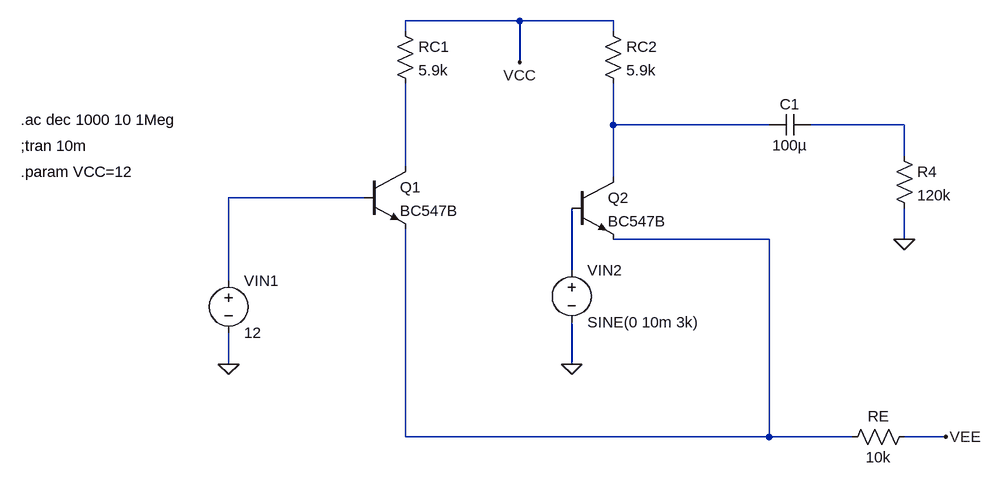
[diagram p0: schematic 1_preamp.asc]
1_preamp.asc, the LTspice schematic file:
Version 4
SHEET 1 1004 680
WIRE 288 -480 112 -480
WIRE 432 -480 288 -480
WIRE 112 -464 112 -480
WIRE 432 -464 432 -480
WIRE 288 -416 288 -480
WIRE 432 -320 432 -384
WIRE 672 -320 432 -320
WIRE 880 -320 736 -320
WIRE 880 -272 880 -320
WIRE 112 -256 112 -384
WIRE 432 -240 432 -320
WIRE 48 -208 -160 -208
WIRE 672 -144 432 -144
WIRE 880 -144 880 -192
WIRE 368 -96 368 -192
WIRE -160 -80 -160 -208
WIRE -160 48 -160 0
WIRE 368 48 368 -16
WIRE 112 160 112 -160
WIRE 672 160 672 -144
WIRE 672 160 112 160
WIRE 800 160 672 160
WIRE 944 160 880 160
FLAG -160 48 0
FLAG 368 48 0
FLAG 880 -144 0
FLAG 288 -416 VCC
FLAG 944 160 VEE
SYMBOL npn 48 -256 R0
SYMATTR InstName Q1
SYMATTR Value BC547B
SYMBOL voltage -160 -96 R0
SYMATTR InstName VIN1
SYMATTR Value 12
SYMBOL res 96 -480 R0
SYMATTR InstName RC1
SYMATTR Value 5.9k
SYMBOL res 416 -480 R0
SYMATTR InstName RC2
SYMATTR Value 5.9k
SYMBOL npn 368 -240 R0
SYMATTR InstName Q2
SYMATTR Value BC547B
SYMBOL voltage 368 -112 R0
WINDOW 123 0 0 Left 0
WINDOW 39 0 0 Left 0
SYMATTR InstName VIN2
SYMATTR Value SINE(0 10m 3k)
SYMBOL res 896 144 R90
WINDOW 0 0 56 VBottom 2
WINDOW 3 32 56 VTop 2
SYMATTR InstName RE
SYMATTR Value 10k
SYMBOL cap 736 -336 R90
WINDOW 0 0 32 VBottom 2
WINDOW 3 32 32 VTop 2
SYMATTR InstName C1
SYMATTR Value 100µ
SYMBOL res 864 -288 R0
SYMATTR InstName R4
SYMATTR Value 120k
TEXT -480 -328 Left 2 !.ac dec 1000 10 1Meg
TEXT -480 -288 Left 2 !;tran 10m
TEXT -480 -248 Left 2 !.param VCC=12

The netlist it stands for:
* 1_preamp.asc
Q1 N003 N004 N005 0 BC547B
VIN1 N004 0 12
RC1 VCC N003 5.9k
RC2 VCC N001 5.9k
Q2 N001 N006 N005 0 BC547B
VIN2 N006 0 SINE(0 10m 3k)
RE VEE N005 10k
C1 N002 N001 100µ
R4 N002 0 120k
.model NPN NPN
.model PNP PNP
.lib standard.bjt
.ac dec 1000 10 1Meg
;tran 10m
.param VCC=12
.backanno
.end